# Altium schematic sheet JTAG_Configuration.SchDoc: =ProjectName
size 420 x 297 mm; Author: T.P.; CompanyName: WUT; DrawnBy: T.P.; Organization: WUT ISE; Address1: Warsaw Univeristy of Technology; Address2: Nowowiejska 15/19; DocumentNumber: 33; Revision: 0.9; SheetNumber: 33; SheetTotal: 36; EDA_Number: ARTIQ; Projet: ARTIQ/SINARA; ModifiedBy: -; CreateDate: XX/XX/XXXX; CheckedDate: -; Title2: JTAG_Configuration.SchDoc; DivGrp: ISE; Designer: G.K. and T.P.; ModifiedDate: -; ProjectName: ADC/DAC MEZZANINE
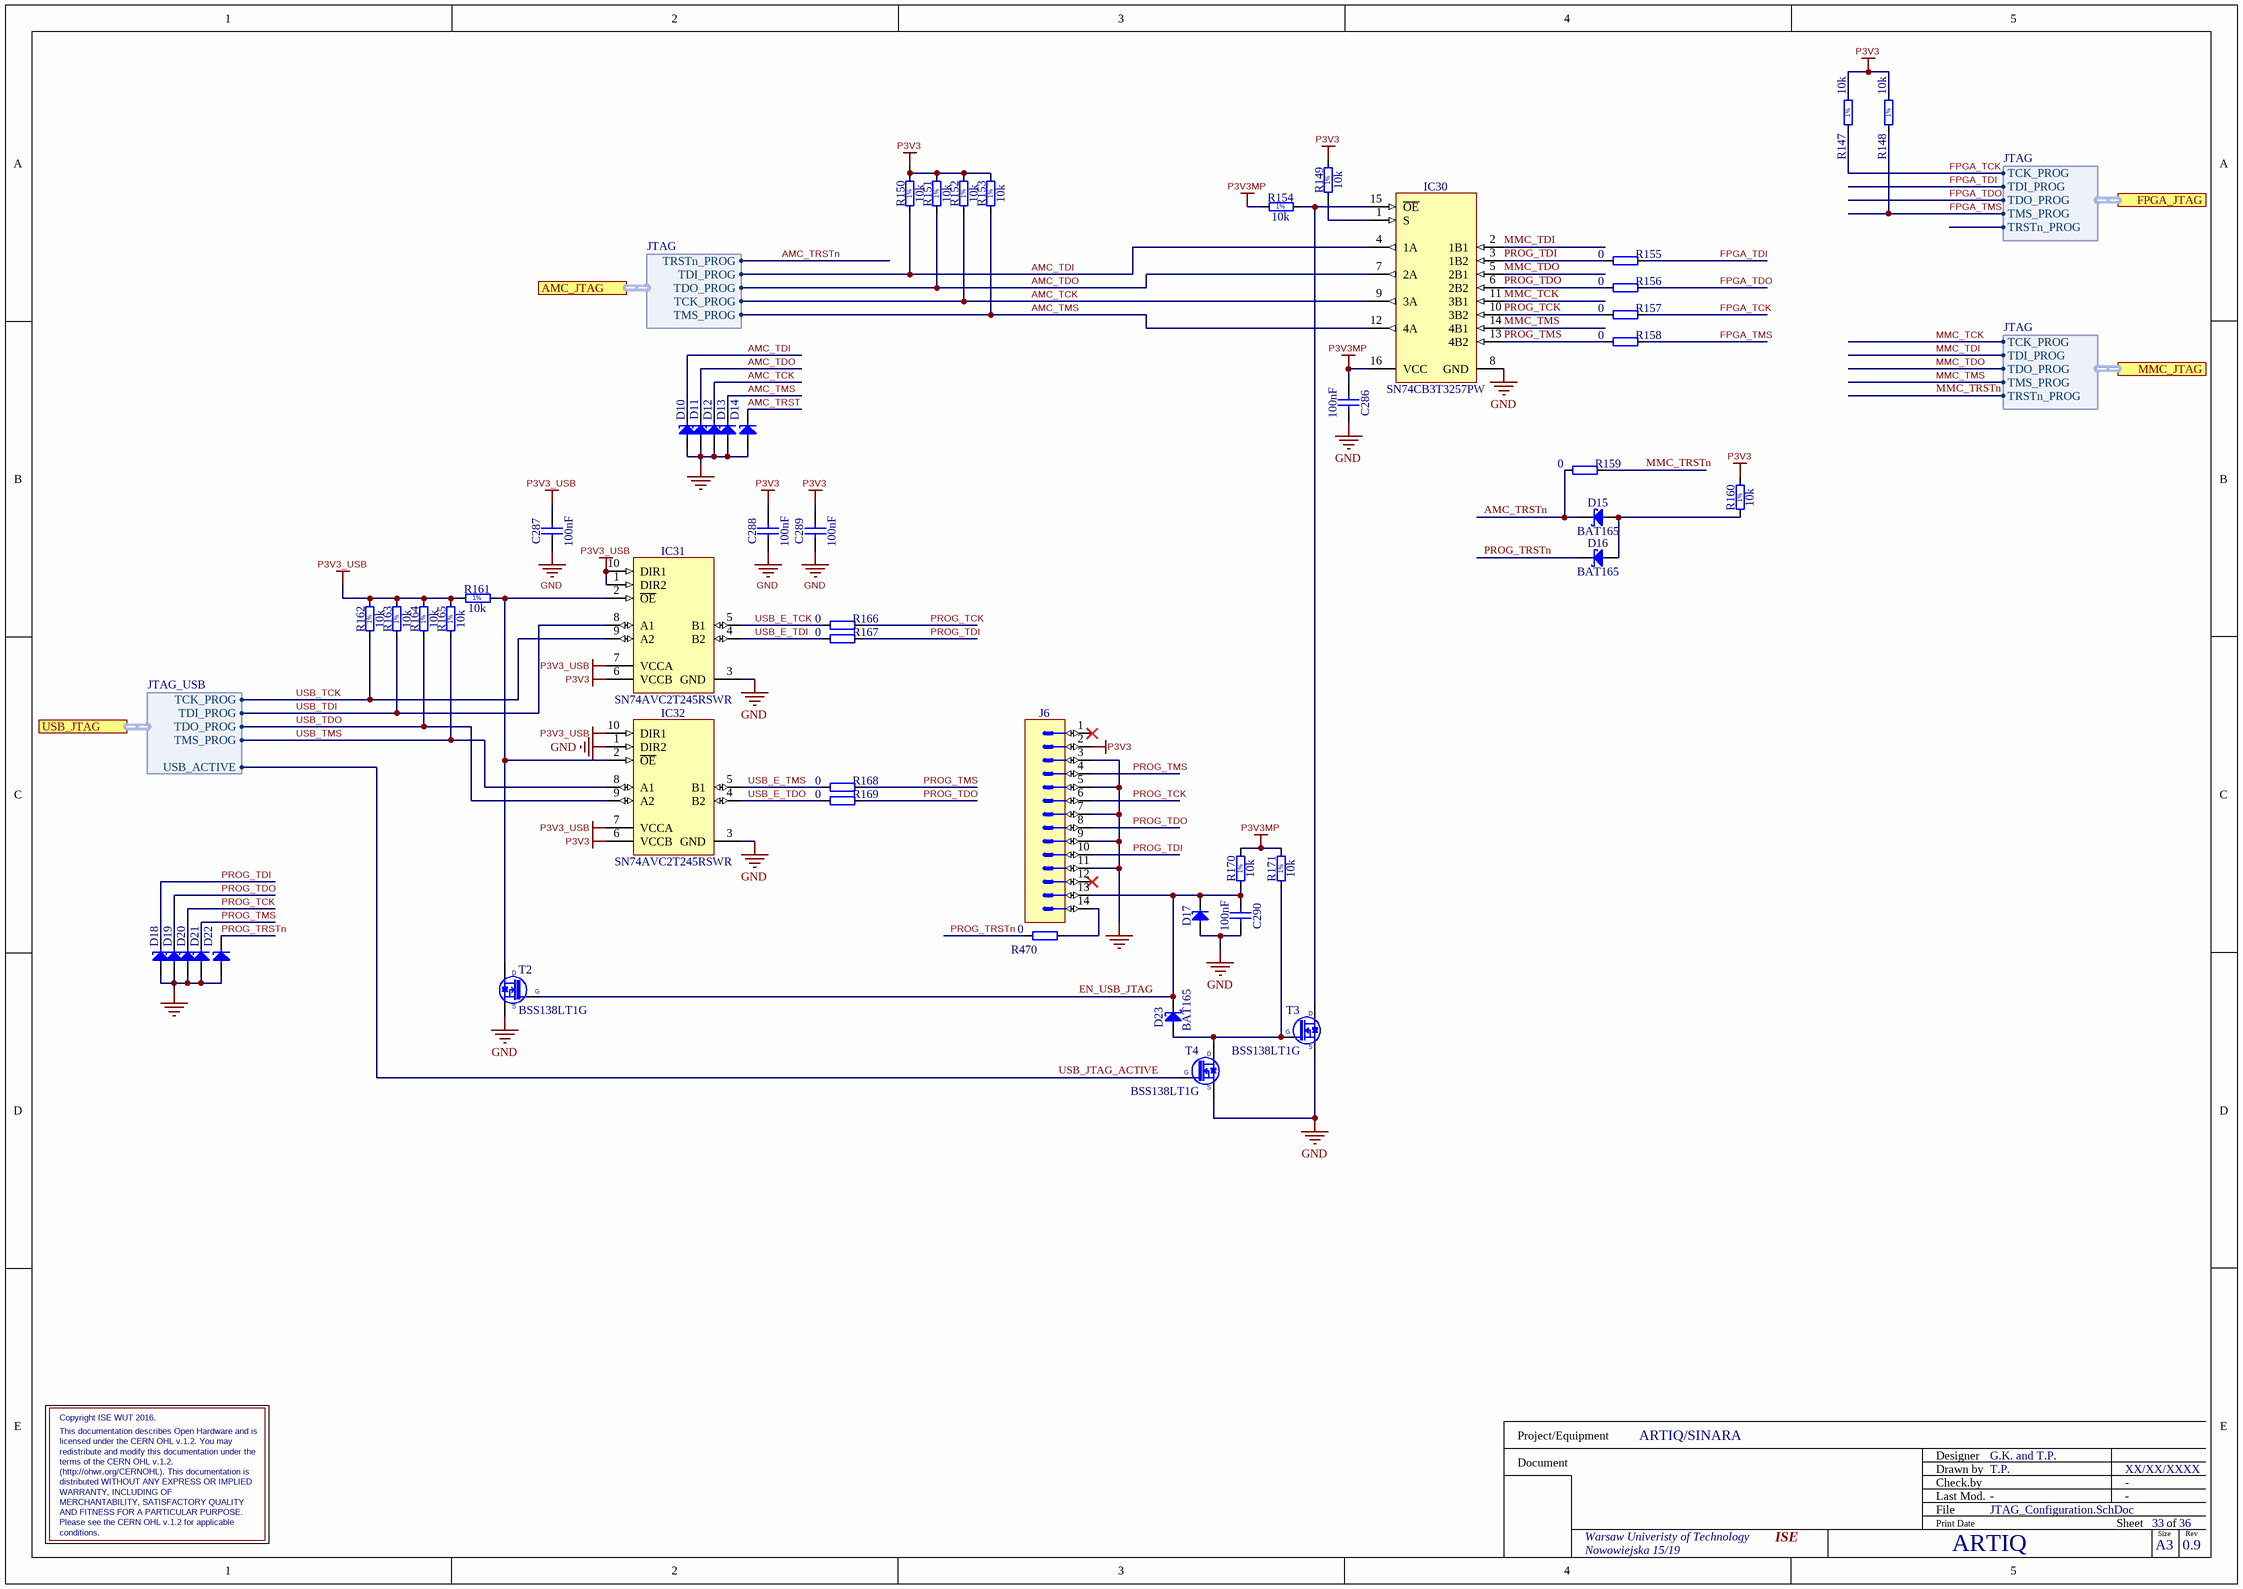
[diagram p0: JTAG_Configuration.SchDoc]

## Parts
C286  100nF  [CAPC0603X33N]
C287  100nF  [CAPC0603X33N]
C288  100nF  [CAPC0603X33N]
C289  100nF  [CAPC0603X33N]
C290  100nF  [CAPC0603X33N]
D10  PESD3V3S1UB  [SODFL1608X65N]  (value not drawn)
D11  PESD3V3S1UB  [SODFL1608X65N]  (value not drawn)
D12  PESD3V3S1UB  [SODFL1608X65N]  (value not drawn)
D13  PESD3V3S1UB  [SODFL1608X65N]  (value not drawn)
D14  PESD3V3S1UB  [SODFL1608X65N]  (value not drawn)
D15  BAT165  [SOD2512X110N]
D16  BAT165  [SOD2512X110N]
D17  PESD3V3S1UB  [SODFL1608X65N]  (value not drawn)
D18  PESD3V3S1UB  [SODFL1608X65N]  (value not drawn)
D19  PESD3V3S1UB  [SODFL1608X65N]  (value not drawn)
D20  PESD3V3S1UB  [SODFL1608X65N]  (value not drawn)
D21  PESD3V3S1UB  [SODFL1608X65N]  (value not drawn)
D22  PESD3V3S1UB  [SODFL1608X65N]  (value not drawn)
D23  BAT165  [SOD2512X110N]
IC30  SN74CB3T3257PW  [SOP65P640X120-16N]
IC31  SN74AVC2T245RSWR  [QFN40P140X180X55-10N]
IC32  SN74AVC2T245RSWR  [QFN40P140X180X55-10N]
J6  Milli-Grid™  [MOLEX_87832-1420]  (value not drawn)
R147  10k  [RESC1005X40N]
R148  10k  [RESC1005X40N]
R149  10k  [RESC1005X40N]
R150  10k  [RESC1005X40N]
R151  10k  [RESC1005X40N]
R152  10k  [RESC1005X40N]
R153  10k  [RESC1005X40N]
R154  10k  [RESC1005X40N]
R155  0  [RESC1005X40N]
R156  0  [RESC1005X40N]
R157  0  [RESC1005X40N]
R158  0  [RESC1005X40N]
R159  0  [RESC1005X40N]
R160  10k  [RESC1005X40N]
R161  10k  [RESC1005X40N]
R162  10k  [RESC1005X40N]
R163  10k  [RESC1005X40N]
R164  10k  [RESC1005X40N]
R165  10k  [RESC1005X40N]
R166  0  [RESC1005X40N]
R167  0  [RESC1005X40N]
R168  0  [RESC1005X40N]
R169  0  [RESC1005X40N]
R170  10k  [RESC1005X40N]
R171  10k  [RESC1005X40N]
R470  0  [RESC1005X40N]
T2  BSS138LT1G  [SOT95P240X110-3N]
T3  BSS138LT1G  [SOT95P240X110-3N]
T4  BSS138LT1G  [SOT95P240X110-3N]

## Ports
AMC_JTAG (harness JTAG), FPGA_JTAG (harness JTAG), MMC_JTAG (harness JTAG), USB_JTAG (harness JTAG_USB)

## Harnesses
JTAG: TDO_PROG, TDI_PROG, TCK_PROG, TMS_PROG, TRSTn_PROG
JTAG_USB: TDO_PROG, TDI_PROG, TCK_PROG, TMS_PROG, USB_ACTIVE

## Nets
GND: C286.1 C287.1 C288.1 C289.1 C290.1 D10.2(A) D11.2(A) D12.2(A) D13.2(A) D14.2(A) D17.2(A) D18.2(A) D19.2(A) D20.2(A) D21.2(A) D22.2(A) IC30.8(GND) IC31.3(GND) IC32.1(DIR2) IC32.3(GND) J6.3 J6.5 J6.7 J6.9 J6.11 T2.2(S) T3.2(S) T4.2(S)
P3V3: C288.2 C289.2 IC31.6(VCCB) IC32.6(VCCB) J6.2 R147.1 R148.1 R149.2 R150.2 R151.2 R152.2 R153.2 R160.2
P3V3_USB: C287.2 IC31.1(DIR2) IC31.7(VCCA) IC31.10(DIR1) IC32.7(VCCA) IC32.10(DIR1) R161.1 R162.2 R163.2 R164.2 R165.2
P3V3MP: C286.2 IC30.16(VCC) R154.1 R170.2 R171.2
AMC_TCK: D12.1(C) IC30.9(3A) R152.1 ; port AMC_JTAG.TCK_PROG
AMC_TDI: D10.1(C) IC30.4(1A) R150.1 ; port AMC_JTAG.TDI_PROG
AMC_TDO: D11.1(C) IC30.7(2A) R151.1 ; port AMC_JTAG.TDO_PROG
AMC_TMS: D13.1(C) IC30.12(4A) R153.1 ; port AMC_JTAG.TMS_PROG
AMC_TRST: D14.1(C)
AMC_TRSTn: D15.1(C) R159.2 ; port AMC_JTAG.TRSTn_PROG
EN_USB_JTAG: C290.2 D17.1(C) D23.1(C) J6.13 R170.1 T2.1(G)
FPGA_TCK: R147.2 R157.1 ; port FPGA_JTAG.TCK_PROG
FPGA_TDI: R155.1 ; port FPGA_JTAG.TDI_PROG
FPGA_TDO: R156.1 ; port FPGA_JTAG.TDO_PROG
FPGA_TMS: R148.2 R158.1 ; port FPGA_JTAG.TMS_PROG
MMC_TCK: IC30.11(3B1) ; port MMC_JTAG.TCK_PROG
MMC_TDI: IC30.2(1B1) ; port MMC_JTAG.TDI_PROG
MMC_TDO: IC30.5(2B1) ; port MMC_JTAG.TDO_PROG
MMC_TMS: IC30.14(4B1) ; port MMC_JTAG.TMS_PROG
MMC_TRSTn: R159.1 ; port MMC_JTAG.TRSTn_PROG
PROG_TCK: D20.1(C) IC30.10(3B2) J6.6 R157.2 R166.1
PROG_TDI: D18.1(C) IC30.3(1B2) J6.10 R155.2 R167.1
PROG_TDO: D19.1(C) IC30.6(2B2) J6.8 R156.2 R169.1
PROG_TMS: D21.1(C) IC30.13(4B2) J6.4 R158.2 R168.1
PROG_TRSTn: D16.1(C) D22.1(C) R470.2
USB_E_TCK: IC31.5(B1) R166.2
USB_E_TDI: IC31.4(B2) R167.2
USB_E_TDO: IC32.4(B2) R169.2
USB_E_TMS: IC32.5(B1) R168.2
USB_JTAG_ACTIVE: T4.1(G) ; port USB_JTAG.USB_ACTIVE
USB_TCK: IC31.9(A2) R162.1 ; port USB_JTAG.TCK_PROG
USB_TDI: IC31.8(A1) R163.1 ; port USB_JTAG.TDI_PROG
USB_TDO: IC32.9(A2) R164.1 ; port USB_JTAG.TDO_PROG
USB_TMS: IC32.8(A1) R165.1 ; port USB_JTAG.TMS_PROG
NetD15_2: D15.2(A) D16.2(A) R160.1
NetD23_2: D23.2(A) R171.1 T3.1(G) T4.3(D)
NetIC30_1: IC30.1(S) R149.1
NetIC30_15: IC30.15(~{OE}) R154.2 T3.3(D)
NetIC31_2: IC31.2(~{OE}) IC32.2(~{OE}) R161.2 T2.3(D)
NetJ6_14: J6.14 R470.1

Not connected (* = marked no-connect by the designer): J6 1* 12*

## Notes on the sheet
- Copyright ISE WUT 2016.
- (http://ohwr.org/CERNOHL). This documentation is
- This documentation describes Open Hardware and is
- distributed WITHOUT ANY EXPRESS OR IMPLIED
- licensed under the CERN OHL v.1.2. You may
- terms of the CERN OHL v.1.2.
- redistribute and modify this documentation under the
- conditions.
- MERCHANTABILITY, SATISFACTORY QUALITY
- Please see the CERN OHL v.1.2 for applicable
- AND FITNESS FOR A PARTICULAR PURPOSE.
- WARRANTY, INCLUDING OF
- Project/Equipment
- Document
- Designer
- Drawn by
- Check.by
- File
- Last Mod.
- Print Date
- Sheet
- Size
- A3
- of
- Rev
- (in symbol R0402_10K_1%_0.0625W_100PPM) 1%

## Library data of the parts
C286 C290 = CC0201_100NF_6.3V_10%_X5R: Non-polarised capacitor; Manufacturer: GENERIC; Part Description: SMD Multilayer Chip Ceramic Capacitor; Manufacturer1 Part Number: 02016D104KAT2A; Tolerance: ±10%; Voltage: 6.3V; TC: X5R; Manufacturer Part Number: CC0201_100NF_6.3V_10%_X5R; Part Number: CC0201_100NF_6.3V_10%_X5R; Value: 100nF; Component Kind: Standard; Component Type: Standard; Pin Count: 2; Status: Not Recommended; Case: 0201; Mounted: Yes; Socket: No; SMD: Yes; Sense: No; Manufacturer1 Example: AVX; Manufacturer1 ComponentHeight: 0.33mm; HelpURL: \\cern.ch\dfs\Applications\Altium\Datasheets\CC0201_X5R_AVX.pdf; Author: CERN DEM JLC; CreateDate: 03.12.2007; LatestRevisionDate: 03.12.2007
C287-C289 = CC0201_100NF_6.3V_10%_X5R: Non-polarised capacitor; Manufacturer: GENERIC; Manufacturer1 Part Number: 02016D104KAT2A; Part Description: SMD Multilayer Chip Ceramic Capacitor; TC: X5R; Tolerance: ±10%; Voltage: 6.3V; Author: CERN DEM JLC; Case: 0201; Component Kind: Standard; Component Type: Standard; CreateDate: 03.12.2007; HelpURL: \\cern.ch\dfs\Applications\Altium\Datasheets\CC0201_X5R_AVX.pdf; LatestRevisionDate: 03.12.2007; Manufacturer Part Number: CC0201_100NF_6.3V_10%_X5R; Manufacturer1 ComponentHeight: 0.33mm; Manufacturer1 Example: AVX; Mounted: Yes; Part Number: CC0201_100NF_6.3V_10%_X5R; Pin Count: 2; SMD: Yes; Socket: No; Status: Not Recommended; Value: 100nF; Sense: No
D10-D14 D18-D22 = PESD3V3S1UB: ESD protection diode; Manufacturer: NXP SEMICONDUCTORS; Part Description: ESD protection diode (23kV); Voltage: 3V3; Power: 330W; PressFit: No; Bonding: No; Manufacturer Part Number: PESD3V3S1UB; PackageDescription: Ultra Small Outline Diode Flat Lead (SOD-523), Body; 1.2mm L X 0.8mm W X 0.65mm H, IPC Medium Density; Part Number: PESD3V3S1UB; Component Kind: Standard; Component Type: Standard; Device: PESD3V3S1UB; Pin Count: 2; Case: SOD523; Mounted: Yes; Socket: No; SMD: Yes; Sense: No; ComponentHeight: 0.65mm; HelpURL: \\cern.ch\dfs\Applications\Altium\Datasheets\PESD3V3S1UB.pdf; Author: CERN DEM JLC; CreateDate: 29.11.2012; LatestRevisionDate: 29.11.2012
D15 D16 D23 = BAT165: Schottky Diode; Part Description: Medium Power AF Schottky Diode; Manufacturer: INFINEON; Voltage: 40V; Power: 750mA; PressFit: No; Bonding: No; Part Number: BAT165; Component Kind: Standard; Component Type: Standard; Device: BAT165; PackageDescription: Small Outline Diode (SOD-323), 1.70mm W X 1.25mm L X 1.10mm H body,  IPC Medium Density; Manufacturer Part Number: BAT165; Pin Count: 2; Case: SOD323; Mounted: Yes; Socket: No; SMD: Yes; Sense: No; ComponentHeight: 1.1mm; HelpURL: \\cern.ch\dfs\Applications\Altium\Datasheets\BAT165.pdf; Author: CERN DEM JLC; CreateDate: 12.11.2014; LatestRevisionDate: 12.11.2014
D17 = PESD3V3S1UB: ESD protection diode; Part Description: ESD protection diode (23kV); Manufacturer: NXP SEMICONDUCTORS; Voltage: 3V3; Power: 330W; PressFit: No; Bonding: No; Part Number: PESD3V3S1UB; Component Kind: Standard; Component Type: Standard; Device: PESD3V3S1UB; PackageDescription: Ultra Small Outline Diode Flat Lead (SOD-523), Body; 1.2mm L X 0.8mm W X 0.65mm H, IPC Medium Density; Manufacturer Part Number: PESD3V3S1UB; Pin Count: 2; Case: SOD523; Mounted: Yes; Socket: No; SMD: Yes; Sense: No; ComponentHeight: 0.65mm; HelpURL: \\cern.ch\dfs\Applications\Altium\Datasheets\PESD3V3S1UB.pdf; Author: CERN DEM JLC; CreateDate: 29.11.2012; LatestRevisionDate: 29.11.2012
IC30 = SN74CB3T3257PW: 4-BIT 1-OF-2 FET Multiplexer/Demultiplexer 2.5V/3.3V Low-Voltage Bus Switch 5V Tolerant Shifter; Manufacturer: TEXAS INSTRUMENTS; PressFit: No; Bonding: No; Part Number: SN74CB3T3257PW; Component Kind: Standard; Component Type: Standard; Device: SN74CB3T3257PW; PackageDescription: SOP, 0.65mm pitch; 16 pin, 4.40mm W X 5.00mm L X 1.20mm H body IPC Medium Density; Part Description: 4-Bit 1-of-2 FET Multiplexer/Demultiplexer 2.5V/3.3V Low-Voltage Bus Switch 5V Tolerant Shifter; Manufacturer Part Number: SN74CB3T3257PW; Pin Count: 16; Case: TSSOP16; Mounted: Yes; Socket: No; SMD: Yes; Sense: No; ComponentHeight: 1.2mm; Author: CERN DEM JLC; HelpURL: \\cern.ch\dfs\Applications\Altium\Datasheets\SN74CB3T3257PW.pdf; CreateDate: 30.01.2012; LatestRevisionDate: 30.01.2012
IC31 IC32 = SN74AVC2T245RSWR: Dual-Bit Dual-Supply Bus Transceiver With Configurable Voltage Translation and 3-State Outputs; Manufacturer: TEXAS INSTRUMENTS; PressFit: No; Bonding: No; Part Number: SN74AVC2T245RSWR; Component Kind: Standard; Component Type: Standard; Device: SN74AVC2T245RSWR; PackageDescription: QFN, 0.40mm Pitch, Rect.;10 Pin, 1.80mm L X 1.40mm W X 0.55mm H Body, IPC Medium Density; Status: Not Recommended; Part Description: Dual-Bit Dual-Supply Bus Transceiver With Configurable Voltage Translation and 3-State Outputs; Manufacturer Part Number: SN74AVC2T245RSWR; Pin Count: 10; Case: QFN10; Mounted: Yes; Socket: No; SMD: Yes; Sense: No; ComponentHeight: 0.55mm; Author: CERN DEM JLC; HelpURL: \\cern.ch\dfs\Applications\Altium\Datasheets\SN74AVC2T245RSWR.pdf; CreateDate: 07.07.2014; LatestRevisionDate: 30.03.2017
J6 = MOLEX_87832-1420: Connector 14 Male; Manufacturer: MOLEX; Part Description: 2.00mm (.079") Pitch Milli-Grid™ Header, Surface Mount, Vertical, Shrouded, 14 Circuits,with Locking Windows and Centre Polarization Slot, PCB Locator; PressFit: No; Manufacturer Part Number: 87832-1420; Part Number: MOLEX_87832-1420; Component Kind: Standard; Component Type: Standard; Pin Count: 14; Family: Milli-Grid™; Mounted: Yes; Socket: No; SMD: Yes; Sense: No; Status: None; ComponentHeight: 7.6mm; HelpURL: \\cern.ch\dfs\Applications\Altium\Datasheets\MOLEX_87832-1420.pdf; Author: CERN DEM JLC; CreateDate: 09.09.2008; LatestRevisionDate: 09.09.2008
R147-R154 R160 R162-R165 R170 R171 = R0402_10K_1%_0.0625W_100PPM: Resistor - 1%; Manufacturer: GENERIC; Part Description: General Purpose Thick Film Chip Resistor; Manufacturer1 Part Number: 232270671003L; TC: ±100ppm/°C; PressFit: No; Manufacturer Part Number: R0402_10K_1%_0.0625W_100PPM; Part Number: R0402_10K_1%_0.0625W_100PPM; Tolerance: ±1%; Value: 10k; Component Kind: Standard; Component Type: Standard; Pin Count: 2; Status: Not Recommended; Power: 0.0625W; Case: 0402; Mounted: Yes; Sense: No; Socket: No; SMD: Yes; Manufacturer1 Example: YAGEO PHYCOMP; Manufacturer1 ComponentHeight: 0.4mm; HelpURL: \\cern.ch\dfs\Applications\Altium\Datasheets\R0402_Phycomp_RC0402.pdf; Author: CERN DEM JLC; CreateDate: 03.12.2007; LatestRevisionDate: 17.10.2012
R155-R159 R166-R169 R470 = R0402_0R_JUMPER: Resistor; Manufacturer: GENERIC; Part Description: 1A (0.05R Max DC Resistance) Zero Ohm Jumper; Manufacturer1 Part Number: 232270591001L; PressFit: No; Manufacturer Part Number: R0402_0R_JUMPER; Part Number: R0402_0R_JUMPER; Value: 0; Component Kind: Standard; Component Type: Standard; Pin Count: 2; Status: Not Recommended; Case: 0402; Mounted: Yes; Sense: No; Socket: No; SMD: Yes; Manufacturer1 Example: YAGEO PHYCOMP; Manufacturer1 ComponentHeight: 0.4mm; HelpURL: \\cern.ch\dfs\Applications\Altium\Datasheets\R0402_Phycomp_RC0402.pdf; Author: CERN DEM JLC; CreateDate: 03.12.2007; LatestRevisionDate: 17.10.2012
R161 = R0402_10K_1%_0.0625W_100PPM: Resistor - 1%; Part Description: General Purpose Thick Film Chip Resistor; Manufacturer: GENERIC; Manufacturer1 Part Number: 232270671003L; TC: ±100ppm/°C; PressFit: No; Part Number: R0402_10K_1%_0.0625W_100PPM; Component Kind: Standard; Component Type: Standard; Pin Count: 2; Value: 10k; Status: Not Recommended; Power: 0.0625W; Tolerance: ±1%; Manufacturer Part Number: R0402_10K_1%_0.0625W_100PPM; Case: 0402; Mounted: Yes; Sense: No; Socket: No; SMD: Yes; Manufacturer1 Example: YAGEO PHYCOMP; Manufacturer1 ComponentHeight: 0.4mm; HelpURL: \\cern.ch\dfs\Applications\Altium\Datasheets\R0402_Phycomp_RC0402.pdf; Author: CERN DEM JLC; CreateDate: 03.12.2007; LatestRevisionDate: 17.10.2012
T2-T4 = BSS138LT1G: N-CHANNEL MOSFET WITH DIODE; Part Description: 50V 200mA N-Channel Enhancement Mode Field-Effect Transistor; Manufacturer: ON SEMICONDUCTOR; PressFit: No; Bonding: No; Part Number: BSS138LT1G; Component Kind: Standard; Component Type: Standard; Device: BSS138LT1G; PackageDescription: SOT23 3-Leads, Pitch 0.95mm - Body 1.4x3mm, IPC Medium Density; Manufacturer Part Number: BSS138LT1G; Pin Count: 3; Case: SOT23-3; Mounted: Yes; Socket: No; SMD: Yes; Sense: No; ComponentHeight: 1.11mm; HelpURL: \\cern.ch\dfs\Applications\Altium\Datasheets\BSS138LT1G.pdf; Author: CERN DEM JLC; CreateDate: 23.03.2009; LatestRevisionDate: 23.03.2009